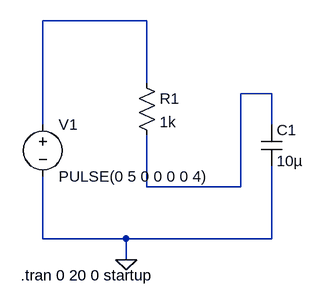
[diagram p0: schematic variable_voltage_genrator.asc]
variable_voltage_genrator.asc, the LTspice schematic file:
Version 4
SHEET 1 880 680
WIRE 128 -64 -32 -64
WIRE 128 32 128 -64
WIRE 320 48 272 48
WIRE -32 96 -32 -64
WIRE 320 96 320 48
WIRE 128 192 128 112
WIRE 272 192 272 48
WIRE 272 192 128 192
WIRE -32 272 -32 176
WIRE 96 272 -32 272
WIRE 320 272 320 160
WIRE 320 272 96 272
WIRE 96 304 96 272
FLAG 96 304 0
SYMBOL voltage -32 80 R0
WINDOW 123 0 0 Left 0
WINDOW 39 0 0 Left 0
SYMATTR InstName V1
SYMATTR Value PULSE(0 5 0 0 0 0 4)
SYMBOL res 112 16 R0
SYMATTR InstName R1
SYMATTR Value 1k
SYMBOL cap 304 96 R0
SYMATTR InstName C1
SYMATTR Value 10µ
TEXT -66 328 Left 2 !.tran 0 20 0 startup

The netlist it stands for:
* variable_voltage_genrator.asc
V1 N001 0 PULSE(0 5 0 0 0 0 4)
R1 N001 N002 1k
C1 N002 0 10µ
.tran 0 20 0 startup
.backanno
.end